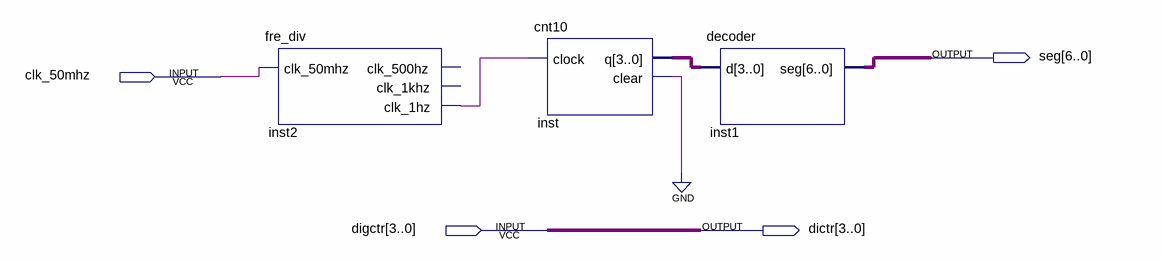
[diagram p0: schematic sheet]
// Quartus schematic sevenseg_display_cnt10.bdf as structural Verilog: 3 symbols, 4 pins
module sevenseg_display_cnt10 (
  input  clk_50mhz,
  input  [3:0] digctr,
  output [6:0] seg,
  output [3:0] dictr
);

  wire inst2_clk_1hz, inst_clear;
  wire [3:0] inst_q;

  fre_div inst2 (.clk_50mhz(clk_50mhz), .clk_1hz(inst2_clk_1hz));  // open: clk_500hz, clk_1khz
  cnt10 inst (.clock(inst2_clk_1hz), .q(inst_q), .clear(inst_clear));
  decoder inst1 (.d(inst_q), .seg(seg));

  assign dictr = digctr;
  // also tied to GND on the sheet: inst_clear
endmodule
